# Altium schematic sheet PATHOS_FPGA_MemoryInterface.SchDoc: FPGA SOM Memory Interface
size A4; Author: A. Kalberer; CompanyName: NTB; Organization: NTB Interstate University of Applied; Address1: Werdenbergstrasse 4; Address3: 9471 Buchs; Address4: Switzerland; Organization1: Sciences of Technology Buchs; Size: A4
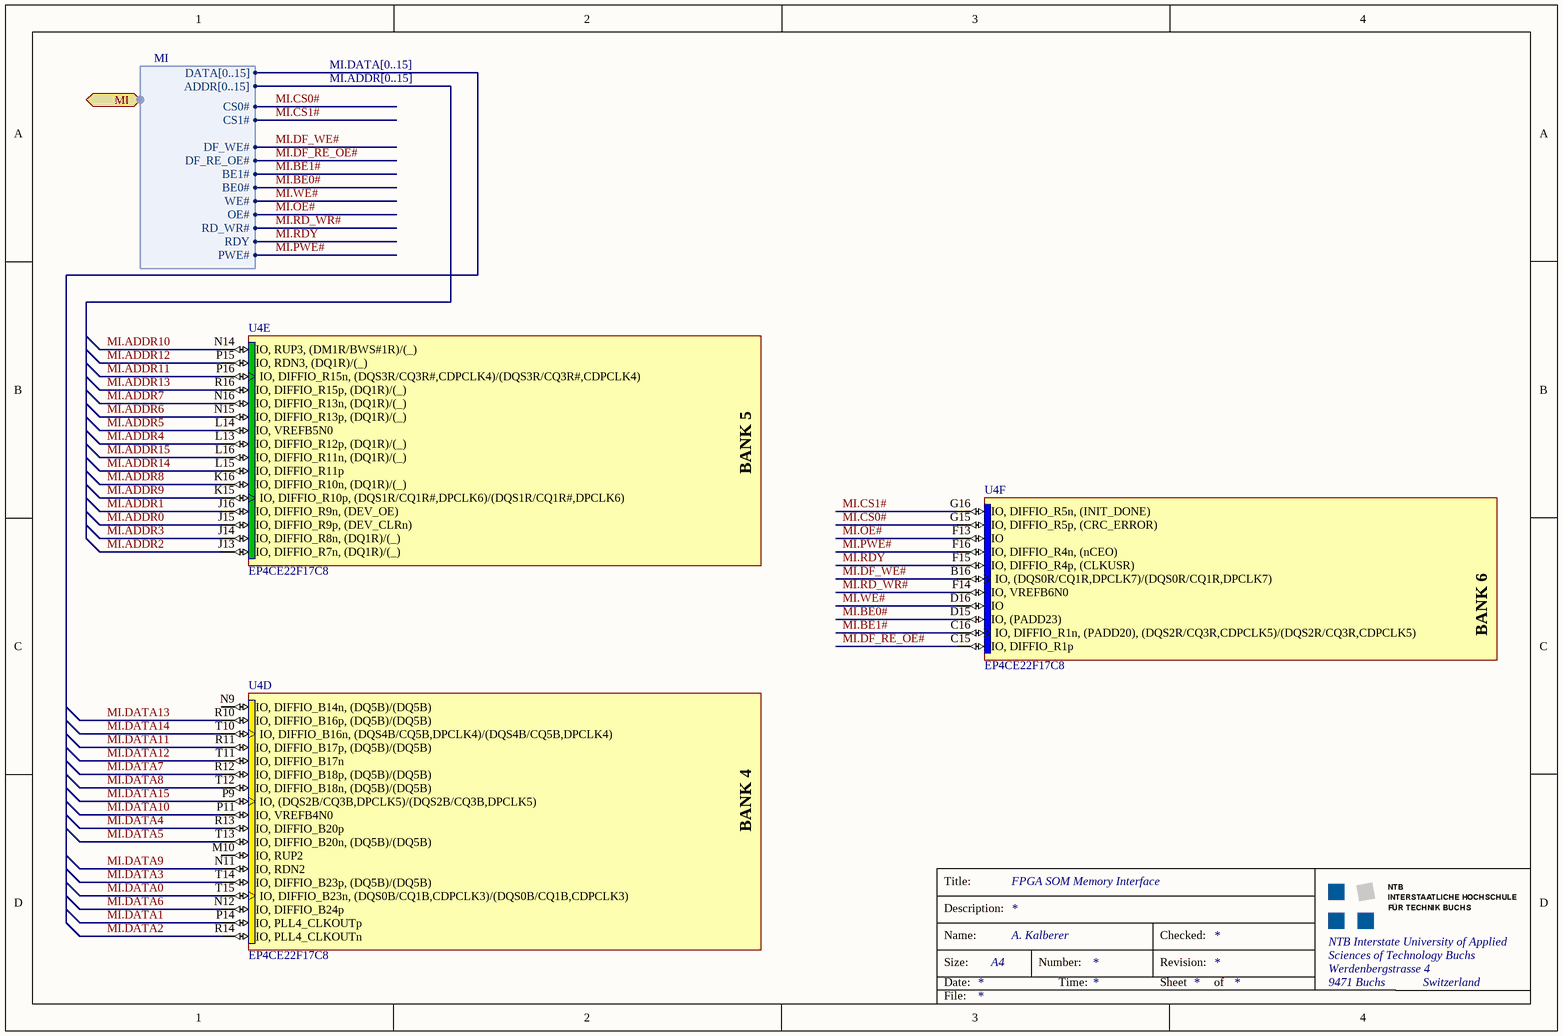
[diagram p0: PATHOS_FPGA_MemoryInterface.SchDoc]

## Parts
U4  EP4CE22F17C8  [FBGA256]  (parts D,E,F of 13)

## Ports
MI (harness MI)

## Harnesses
MI: DATA[0..15], ADDR[0..15], CS0#, DF_WE#, DF_RE_OE#, BE1#, BE0#, WE#, OE#, RD_WR#, RDY, PWE#, CS1#

## Nets
MI.ADDR0: U4.J15(IO,_DIFFIO_R9p,_(DEV_CLRn))
MI.ADDR1: U4.J16(IO,_DIFFIO_R9n,_(DEV_OE))
MI.ADDR2: U4.J13(IO,_DIFFIO_R7n,_(DQ1R)/(_))
MI.ADDR3: U4.J14(IO,_DIFFIO_R8n,_(DQ1R)/(_))
MI.ADDR4: U4.L13(IO,_DIFFIO_R12p,_(DQ1R)/(_))
MI.ADDR5: U4.L14(IO,_VREFB5N0)
MI.ADDR6: U4.N15(IO,_DIFFIO_R13p,_(DQ1R)/(_))
MI.ADDR7: U4.N16(IO,_DIFFIO_R13n,_(DQ1R)/(_))
MI.ADDR8: U4.K16(IO,_DIFFIO_R10n,_(DQ1R)/(_))
MI.ADDR9: U4.K15(IO,_DIFFIO_R10p,_(DQS1R/CQ1R#,DPCLK6)/(DQS1R/CQ1R#,DPCLK6))
MI.ADDR10: U4.N14(IO,_RUP3,_(DM1R/BWS#1R)/(_))
MI.ADDR11: U4.P16(IO,_DIFFIO_R15n,_(DQS3R/CQ3R#,CDPCLK4)/(DQS3R/CQ3R#,CDPCLK4))
MI.ADDR12: U4.P15(IO,_RDN3,_(DQ1R)/(_))
MI.ADDR13: U4.R16(IO,_DIFFIO_R15p,_(DQ1R)/(_))
MI.ADDR14: U4.L15(IO,_DIFFIO_R11p)
MI.ADDR15: U4.L16(IO,_DIFFIO_R11n,_(DQ1R)/(_))
MI.BE0#: U4.D15(IO,_(PADD23)) ; port MI.BE0#
MI.BE1#: U4.C16(IO,_DIFFIO_R1n,_(PADD20),_(DQS2R/CQ3R,CDPCLK5)/(DQS2R/CQ3R,CDPCLK5)) ; port MI.BE1#
MI.CS0#: U4.G15(IO,_DIFFIO_R5p,_(CRC_ERROR)) ; port MI.CS0#
MI.CS1#: U4.G16(IO,_DIFFIO_R5n,_(INIT_DONE)) ; port MI.CS1#
MI.DATA0: U4.T15(IO,_DIFFIO_B23n,_(DQS0B/CQ1B,CDPCLK3)/(DQS0B/CQ1B,CDPCLK3))
MI.DATA1: U4.P14(IO,_PLL4_CLKOUTp)
MI.DATA2: U4.R14(IO,_PLL4_CLKOUTn)
MI.DATA3: U4.T14(IO,_DIFFIO_B23p,_(DQ5B)/(DQ5B))
MI.DATA4: U4.R13(IO,_DIFFIO_B20p)
MI.DATA5: U4.T13(IO,_DIFFIO_B20n,_(DQ5B)/(DQ5B))
MI.DATA6: U4.N12(IO,_DIFFIO_B24p)
MI.DATA7: U4.R12(IO,_DIFFIO_B18p,_(DQ5B)/(DQ5B))
MI.DATA8: U4.T12(IO,_DIFFIO_B18n,_(DQ5B)/(DQ5B))
MI.DATA9: U4.N11(IO,_RDN2)
MI.DATA10: U4.P11(IO,_VREFB4N0)
MI.DATA11: U4.R11(IO,_DIFFIO_B17p,_(DQ5B)/(DQ5B))
MI.DATA12: U4.T11(IO,_DIFFIO_B17n)
MI.DATA13: U4.R10(IO,_DIFFIO_B16p,_(DQ5B)/(DQ5B))
MI.DATA14: U4.T10(IO,_DIFFIO_B16n,_(DQS4B/CQ5B,DPCLK4)/(DQS4B/CQ5B,DPCLK4))
MI.DATA15: U4.P9(IO,_(DQS2B/CQ3B,DPCLK5)/(DQS2B/CQ3B,DPCLK5))
MI.DF_RE_OE#: U4.C15(IO,_DIFFIO_R1p) ; port MI.DF_RE_OE#
MI.DF_WE#: U4.B16(IO,_(DQS0R/CQ1R,DPCLK7)/(DQS0R/CQ1R,DPCLK7)) ; port MI.DF_WE#
MI.OE#: U4.F13(IO) ; port MI.OE#
MI.PWE#: U4.F16(IO,_DIFFIO_R4n,_(nCEO)) ; port MI.PWE#
MI.RD_WR#: U4.F14(IO,_VREFB6N0) ; port MI.RD_WR#
MI.RDY: U4.F15(IO,_DIFFIO_R4p,_(CLKUSR)) ; port MI.RDY
MI.WE#: U4.D16(IO) ; port MI.WE#

Not connected (* = marked no-connect by the designer): U4 M10(IO,_RUP2) N9(IO,_DIFFIO_B14n,_(DQ5B)/(DQ5B))

## Buses and harness runs
bus MI.ADDR[0..15]
bus MI.DATA[0..15]

## Notes on the sheet
- Title:
- Description:
- Size:
- Date:
- Name:
- Number:
- Time:
- Revision:
- Sheet
- Checked:
- of
- File:
- (in symbol EP4CE22F17C8, part D) BANK 4
- (in symbol EP4CE22F17C8, part E) BANK 5
- (in symbol EP4CE22F17C8, part F) BANK 6

## Library data of the parts
U4 = EP4CE22F17C8: Cyclone IV Family FPGA, 2V Core, 153 I/O Pins, 4 PLLs, 256-Pin FBGA, Speed Grade 8, Commercial Grade; Published: 3-May-2010; DatasheetVersion: ver1.2, Mar-2010; PackageVersion: ver16.0, Dec-2009; PackageReference: FBGA256; Publisher: Altium Limited; PackageDescription: 256-Ball FineLine Ball Grid Array (FBGA256) - Option 1 - Wire Bond; Supplier 1: Digi-Key; Supplier Part Number 1: EP4CE22F17C8-ND; Code_JEDEC: MS-034-AAF-1; Code_IPC: BGA100P16X16-256; ComponentLink1Description: Manufacturer Link; ComponentLink1URL: http://www.altera.com/; ComponentLink2Description: Handbook; ComponentLink2URL: http://www.altera.com/literature/hb/cyclone-iv/cyclone4-handbook.pdf; ComponentLink3Description: Pinout Specification; ComponentLink3URL: http://www.altera.com/literature/lit-dp.jsp?category=cyc%204&showspreadsheet=y; ComponentLink4Description: Packaging Specification; ComponentLink4URL: http://www.altera.com/literature/ds/dspkg.pdf